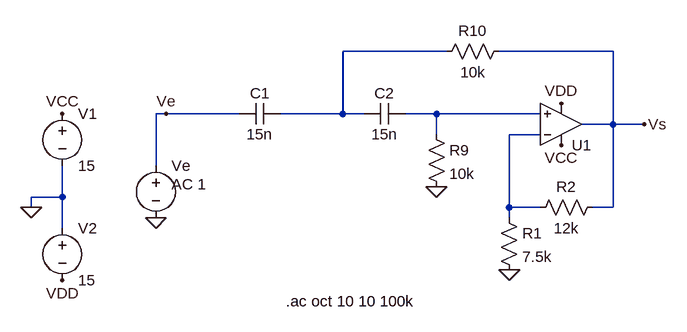
[diagram p0: schematic Passe-Haut.asc]
Passe-Haut.asc, the LTspice schematic file:
Version 4
SHEET 1 880 680
WIRE -64 -448 -224 -448
WIRE 192 -448 16 -448
WIRE -496 -352 -512 -352
WIRE -384 -352 -496 -352
WIRE -224 -352 -224 -448
WIRE -224 -352 -320 -352
WIRE -192 -352 -224 -352
WIRE -80 -352 -128 -352
WIRE 80 -352 -80 -352
WIRE 192 -336 192 -448
WIRE 192 -336 144 -336
WIRE 240 -336 192 -336
WIRE -80 -320 -80 -352
WIRE 80 -320 32 -320
WIRE -512 -272 -512 -352
WIRE -656 -224 -656 -272
WIRE -656 -224 -704 -224
WIRE -704 -208 -704 -224
WIRE 32 -208 32 -320
WIRE 80 -208 32 -208
WIRE 192 -208 192 -336
WIRE 192 -208 160 -208
WIRE 32 -192 32 -208
WIRE -656 -176 -656 -224
FLAG 112 -304 VCC
FLAG 112 -368 VDD
FLAG 32 -112 0
FLAG -80 -240 0
FLAG -704 -208 0
FLAG -656 -352 VCC
FLAG -656 -96 VDD
FLAG -512 -192 0
FLAG 240 -336 Vs
FLAG -496 -352 Ve
SYMBOL UniversalOpamp2 112 -336 M180
SYMATTR InstName U1
SYMBOL res 16 -208 R0
WINDOW 0 36 40 Left 2
WINDOW 3 36 76 Left 2
SYMATTR InstName R1
SYMATTR Value 7.5k
SYMBOL res 176 -224 R90
WINDOW 0 0 56 VBottom 2
WINDOW 3 32 56 VTop 2
SYMATTR InstName R2
SYMATTR Value 12k
SYMBOL res -96 -336 R0
WINDOW 0 36 40 Left 2
WINDOW 3 36 76 Left 2
SYMATTR InstName R9
SYMATTR Value 10k
SYMBOL res 32 -464 R90
WINDOW 0 0 56 VBottom 2
WINDOW 3 32 56 VTop 2
SYMATTR InstName R10
SYMATTR Value 10k
SYMBOL cap -320 -368 R90
WINDOW 0 0 32 VBottom 2
WINDOW 3 32 32 VTop 2
SYMATTR InstName C1
SYMATTR Value 15n
SYMBOL cap -192 -368 M90
WINDOW 0 0 32 VBottom 2
WINDOW 3 32 32 VTop 2
SYMATTR InstName C2
SYMATTR Value 15n
SYMBOL voltage -656 -368 R0
SYMATTR InstName V1
SYMATTR Value 15
SYMBOL voltage -656 -192 R0
SYMATTR InstName V2
SYMATTR Value 15
SYMBOL voltage -512 -288 R0
WINDOW 123 24 44 Left 2
WINDOW 39 0 0 Left 2
SYMATTR Value2 AC 1
SYMATTR InstName Ve
SYMATTR Value ""
TEXT -312 -64 Left 2 !.ac oct 10 10 100k

The netlist it stands for:
* Passe-Haut.asc
XU1 N002 N003 VCC VDD Vs level.2 Avol=1Meg GBW=10Meg Slew=10Meg ilimit=25m rail=0 Vos=0 phimargin=45 en=0 enk=0 in=0 ink=0 Rin=500Meg  ; pins IN+ IN- V+ V- OUT
R1 N003 0 7.5k
R2 Vs N003 12k
R9 N002 0 10k
R10 Vs N001 10k
C1 N001 Ve 15n
C2 N001 N002 15n
V1 VCC 0 15
V2 0 VDD 15
Ve Ve 0 AC 1
.ac oct 10 10 100k
.lib UniversalOpamps2.sub
.backanno
.end